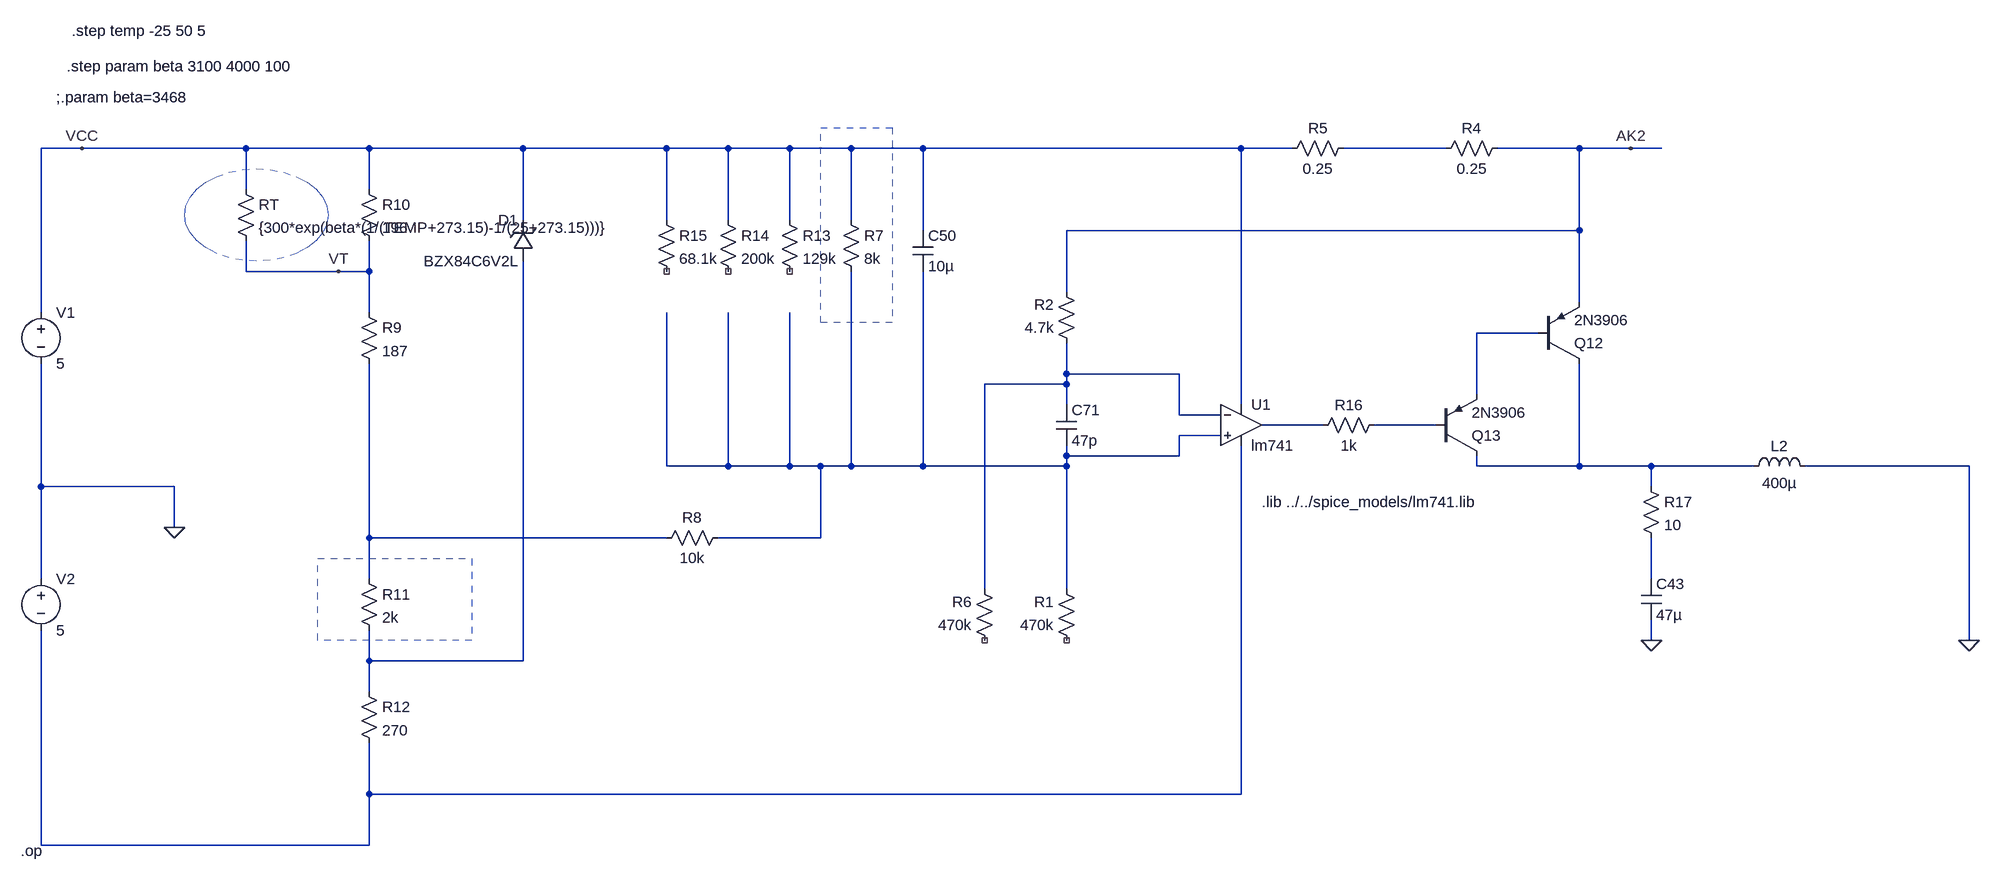
[diagram p0: schematic current_source_dec.asc]
current_source_dec.asc, the LTspice schematic file:
Version 4.1
SHEET 1 3012 1176
WIRE 48 64 -16 64
WIRE 304 64 48 64
WIRE 496 64 304 64
WIRE 736 64 496 64
WIRE 960 64 736 64
WIRE 1056 64 960 64
WIRE 1152 64 1056 64
WIRE 1248 64 1152 64
WIRE 1360 64 1248 64
WIRE 1856 64 1360 64
WIRE 1936 64 1856 64
WIRE 2176 64 2016 64
WIRE 2384 64 2256 64
WIRE 2464 64 2384 64
WIRE 2512 64 2464 64
WIRE 304 128 304 64
WIRE 496 128 496 64
WIRE 736 176 736 64
WIRE 960 176 960 64
WIRE 1056 176 1056 64
WIRE 1152 176 1152 64
WIRE 1248 176 1248 64
WIRE 1360 192 1360 64
WIRE 2384 192 2384 64
WIRE 2384 192 1584 192
WIRE 304 256 304 208
WIRE 448 256 304 256
WIRE 496 256 496 208
WIRE 496 256 448 256
WIRE 1584 288 1584 192
WIRE 2384 304 2384 192
WIRE -16 320 -16 64
WIRE 496 320 496 256
WIRE 2320 352 2224 352
WIRE 1584 416 1584 368
WIRE 1760 416 1584 416
WIRE 1584 432 1584 416
WIRE 1584 432 1456 432
WIRE 2224 448 2224 352
WIRE 1584 464 1584 432
WIRE 1856 464 1856 64
WIRE 1760 480 1760 416
WIRE 1824 480 1760 480
WIRE 1984 496 1888 496
WIRE 2160 496 2064 496
WIRE 1824 512 1760 512
WIRE 1584 544 1584 528
WIRE 1760 544 1760 512
WIRE 1760 544 1584 544
WIRE 960 560 960 320
WIRE 1056 560 1056 320
WIRE 1056 560 960 560
WIRE 1152 560 1152 320
WIRE 1152 560 1056 560
WIRE 1200 560 1152 560
WIRE 1248 560 1248 256
WIRE 1248 560 1200 560
WIRE 1360 560 1360 256
WIRE 1360 560 1248 560
WIRE 1584 560 1584 544
WIRE 1584 560 1360 560
WIRE 2224 560 2224 544
WIRE 2384 560 2384 400
WIRE 2384 560 2224 560
WIRE 2496 560 2384 560
WIRE 2656 560 2496 560
WIRE 2992 560 2736 560
WIRE -16 592 -16 400
WIRE 192 592 -16 592
WIRE 2496 592 2496 560
WIRE 192 656 192 592
WIRE 496 672 496 400
WIRE 960 672 496 672
WIRE 1200 672 1200 560
WIRE 1200 672 1040 672
WIRE -16 736 -16 592
WIRE 496 736 496 672
WIRE 2496 736 2496 672
WIRE 1456 752 1456 432
WIRE 1584 752 1584 560
WIRE 2496 832 2496 800
WIRE 2992 832 2992 560
WIRE 496 864 496 816
WIRE 736 864 736 240
WIRE 736 864 496 864
WIRE 496 912 496 864
WIRE 496 1072 496 992
WIRE 1856 1072 1856 528
WIRE 1856 1072 496 1072
WIRE -16 1152 -16 816
WIRE 496 1152 496 1072
WIRE 496 1152 -16 1152
FLAG 2496 832 0
FLAG 192 656 0
FLAG 2992 832 0
FLAG 448 256 VT
FLAG 48 64 VCC
FLAG 2464 64 AK2
SYMBOL res 480 112 R0
SYMATTR InstName R10
SYMATTR Value 196
SYMBOL res 480 304 R0
SYMATTR InstName R9
SYMATTR Value 187
SYMBOL zener 752 240 R180
WINDOW 0 24 64 Left 2
WINDOW 3 24 0 Left 2
SYMATTR InstName D1
SYMATTR Value BZX84C6V2L
SYMATTR Description Diode
SYMATTR Type diode
SYMBOL res 288 112 R0
SYMATTR InstName RT
SYMATTR Value {300*exp(beta*(1/(TEMP+273.15)-1/(25+273.15)))}
SYMBOL res 480 720 R0
SYMATTR InstName R11
SYMATTR Value 2k
SYMBOL res 480 896 R0
SYMATTR InstName R12
SYMATTR Value 270
SYMBOL res 944 160 R0
SYMATTR InstName R15
SYMATTR Value 68.1k
SYMBOL res 1040 160 R0
SYMATTR InstName R14
SYMATTR Value 200k
SYMBOL res 1136 160 R0
SYMATTR InstName R13
SYMATTR Value 129k
SYMBOL res 1232 160 R0
SYMATTR InstName R7
SYMATTR Value 8k
SYMBOL res 1056 656 R90
WINDOW 0 0 56 VBottom 2
WINDOW 3 32 56 VTop 2
SYMATTR InstName R8
SYMATTR Value 10k
SYMBOL res 1472 848 R180
WINDOW 0 36 76 Left 2
WINDOW 3 36 40 Left 2
SYMATTR InstName R6
SYMATTR Value 470k
SYMBOL res 1600 848 R180
WINDOW 0 36 76 Left 2
WINDOW 3 36 40 Left 2
SYMATTR InstName R1
SYMATTR Value 470k
SYMBOL res 1600 384 R180
WINDOW 0 36 76 Left 2
WINDOW 3 36 40 Left 2
SYMATTR InstName R2
SYMATTR Value 4.7k
SYMBOL res 1920 80 R270
WINDOW 0 32 56 VTop 2
WINDOW 3 0 56 VBottom 2
SYMATTR InstName R5
SYMATTR Value 0.25
SYMBOL res 2160 80 R270
WINDOW 0 32 56 VTop 2
WINDOW 3 0 56 VBottom 2
SYMATTR InstName R4
SYMATTR Value 0.25
SYMBOL res 1968 512 R270
WINDOW 0 32 56 VTop 2
WINDOW 3 0 56 VBottom 2
SYMATTR InstName R16
SYMATTR Value 1k
SYMBOL OpAmps\\opamp2 1856 432 R0
SYMATTR InstName U1
SYMATTR Value lm741
SYMBOL pnp 2160 544 M180
SYMATTR InstName Q13
SYMATTR Value 2N3906
SYMBOL pnp 2320 400 M180
SYMATTR InstName Q12
SYMATTR Value 2N3906
SYMBOL cap 1568 464 R0
SYMATTR InstName C71
SYMATTR Value 47p
SYMBOL cap 1344 192 R0
SYMATTR InstName C50
SYMATTR Value 10µ
SYMBOL res 2480 576 R0
SYMATTR InstName R17
SYMATTR Value 10
SYMBOL cap 2480 736 R0
SYMATTR InstName C43
SYMATTR Value 47µ
SYMBOL ind 2640 576 R270
WINDOW 0 32 56 VTop 2
WINDOW 3 5 56 VBottom 2
SYMATTR InstName L2
SYMATTR Value 400µ
SYMBOL voltage -16 304 R0
WINDOW 123 0 0 Left 0
WINDOW 39 0 0 Left 0
SYMATTR InstName V1
SYMATTR Value 5
SYMBOL voltage -16 720 R0
WINDOW 123 0 0 Left 0
WINDOW 39 0 0 Left 0
SYMATTR InstName V2
SYMATTR Value 5
TEXT 1888 616 Left 2 !.lib ../../spice_models/lm741.lib
TEXT -48 1160 Left 2 !.op
TEXT 32 -120 Left 2 !.step temp -25 50 5
TEXT 8 -16 Left 2 !;.param beta=3468
TEXT 24 -64 Left 2 !.step param beta 3100 4000 100
RECTANGLE Normal 1312 336 1200 32 2
RECTANGLE Normal 656 832 416 704 2
CIRCLE Normal 432 240 208 96 2

The netlist it stands for:
* current_source_dec.asc
R10 VCC VT 196
R9 VT N008 187
D1 N010 VCC BZX84C6V2L
RT VCC VT {300*exp(beta*(1/(TEMP+273.15)-1/(25+273.15)))}
R11 N008 N010 2k
R12 N010 N011 270
R15 VCC NC_01 68.1k
R14 VCC NC_02 200k
R13 VCC NC_03 129k
R7 VCC N006 8k
R8 N006 N008 10k
R6 NC_04 N003 470k
R1 NC_05 N006 470k
R2 N003 AK2 4.7k
R5 VCC N001 0.25
R4 N001 AK2 0.25
R16 N004 N005 1k
X§U1 N006 N003 VCC N011 N004 lm741  ; pins In+ In- V+ V- OUT
Q13 N007 N005 N002 0 2N3906
Q12 N007 N002 AK2 0 2N3906
C71 N003 N006 47p
C50 VCC N006 10µ
R17 N007 N009 10
C43 N009 0 47µ
L2 N007 0 400µ
V1 VCC 0 5
V2 0 N011 5
.model D D
.lib standard.dio
.model NPN NPN
.model PNP PNP
.lib standard.bjt
.lib ../../spice_models/lm741.lib
.op
.step temp -25 50 5
;.param beta=3468
.step param beta 3100 4000 100
.backanno
.end